# Altium schematic sheet machtangap.SchDoc
size A4; SheetNumber: 1; SheetTotal: 1; SPICEModelCacheJOKNZZKW: <root> / <DocumentId>JOKNZZKW</DocumentId> / <CacheFrame Number="0"> / <Model Name="diode" Kind="MDL"> / <Text>*Default Diode / *Diode Pinout: A,K / .MODEL DIODE D()</Text> / </Model> / <Model Name="nmos" Kind="MDL"> / <Text>*Default N-Channel MOSFET / *Pinout: D,G,S / .MODEL NMOS NMOS()</Text> / </Model> / <Model Name="2n3906" Kind="MDL"> / <Text>*2N3906 / *Si 310mW  40V 200mA 250MHz pkg:TO-92B 1,2,3 / .MODEL 2N3906 PNP(IS=4E-14 BF=400 VAF=50 IKF=0.02 ISE=7E-15 NE=1.16 / + BR=7.5 RC=2.4 CJE=6.3E-12 VJE=0.75 TF=5E-10 CJC=5.8E-12 VJC=0.75 TR=2.3E-8 / + VJS=0.75 XTB=1.5 KF=6E-16 )</Text> / </Model> / </CacheFrame> / </root>
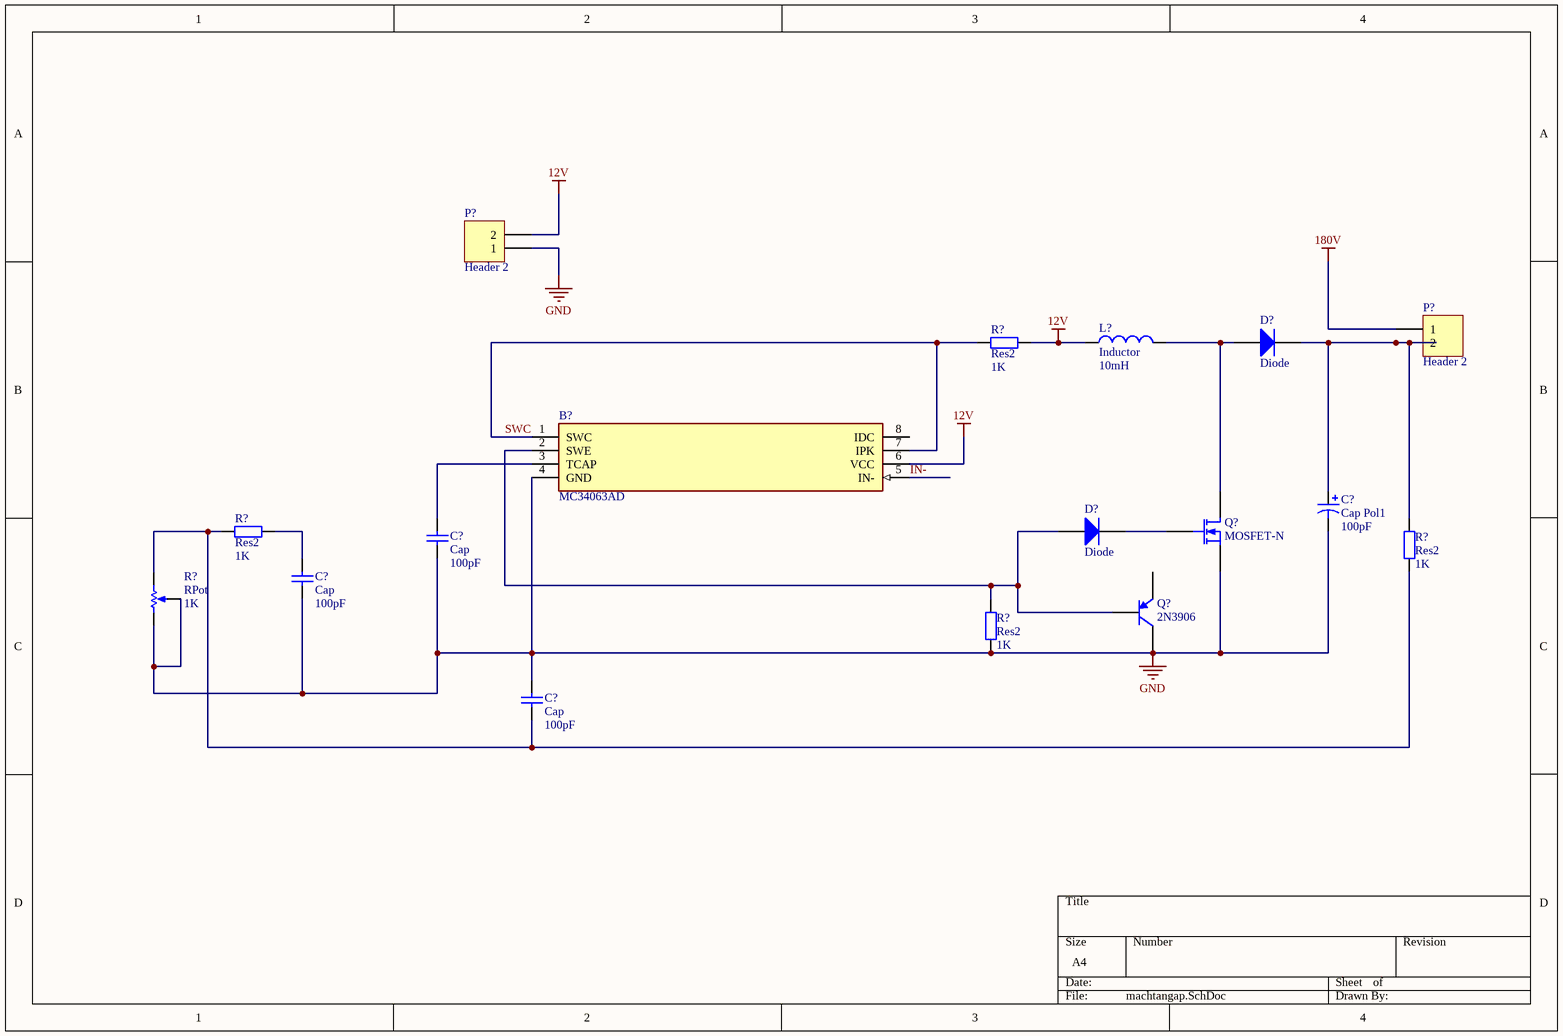
[diagram p0: machtangap.SchDoc]

## Parts
(Parts that share a designator on the sheet are numbered #1, #2 ... from top to bottom, then left to right.)
B?  MC34063AD  [SOIC127P600X175-8N]
C?#1  Cap Pol1  value 100pF  [RB7.6-15]
C?#2  Cap  value 100pF  [RAD-0.3]
C?#3  Cap  value 100pF  [RAD-0.3]
C?#4  Cap  value 100pF  [RAD-0.3]
D?#1  Diode  [SMC]
D?#2  Diode  [SMC]
L?  Inductor  value 10mH  [0402-A]
P?#1  Header 2  [HDR1X2]
P?#2  Header 2  [HDR1X2]
Q?#1  MOSFET-N  [E3]
Q?#2  2N3906  [TO-92A]
R?#1  Res2  value 1K  [AXIAL-0.4]
R?#2  Res2  value 1K  [AXIAL-0.4]
R?#3  Res2  value 1K  [AXIAL-0.4]
R?#4  RPot  value 1K  [VR5]
R?#5  Res2  value 1K  [AXIAL-0.4]

## Nets
12V: B?.6(VCC) L?.1 P?#1.2 R?#1.1
180V: P?#2.1
GND: B?.4(GND) C?#1.2 C?#2.1 C?#3.1 C?#4.2 P?#1.1 Q?#1.3(S) Q?#2.3(C) R?#4.1(TOP) R?#4.3(TAP) R?#5.1
IN-: B?.5(IN-)
SWC: B?.1(SWC) B?.7(IPK) R?#1.2
NetB?_2: B?.2(SWE) D?#2.1(A) Q?#2.2(B) R?#5.2
NetB?_3: B?.3(TCAP) C?#2.2
NetC?#1_1: C?#1.1 D?#1.2(K) P?#2.2 R?#3.2
NetC?#3_2: C?#3.2 R?#2.1
NetC?#4_1: C?#4.1 R?#2.2 R?#3.1 R?#4.2(BOT)
NetD?#1_1: D?#1.1(A) L?.2 Q?#1.1(D)
NetD?#2_2: D?#2.2(K) Q?#1.2(G)

Not connected (* = marked no-connect by the designer): B? 8(IDC); Q?#2 1(E)

## Library data of the parts
B? = MC34063AD: Step up/down converter,MC34063AD 98pcs; Manufacturer_Name: onsemi; Geometry.Height: 1.75mm; Manufacturer_Part_Number: MC34063AD; Mouser Part Number: 512-MC34063AD; Mouser Price/Stock: http://www.mouser.com/Search/ProductDetail.aspx?qs=qJQOsIEC8WHIuBHtgH5ZSQ%3d%3d; Arrow Part Number: MC34063AD; Arrow Price/Stock: https://www.arrow.com/en/products/mc34063ad/on-semiconductor; Datasheet Link: http://www.onsemi.com/pub/Collateral/MC34063A-D.PDF
C?#1 = Cap Pol1: Polarized Capacitor (Radial); Published: 8-Jun-2000; LatestRevisionDate: 17-Jul-2002; LatestRevisionNote: Re-released for DXP Platform.; PackageReference: RB7.6-15; Publisher: Altium Limited; PackageDescription: Polarized Capacitor (Radial); 2 Leads
C?#2-C?#4 = Cap: Capacitor; Published: 8-Jun-2000; LatestRevisionDate: 17-Jul-2002; LatestRevisionNote: Re-released for DXP Platform.; PackageReference: RAD-0.3; Publisher: Altium Limited; PackageDescription: Radial Cap, Thru-Hole; 2 Leads; 0.3 in Pin Spacing
D?#1 D?#2 = Diode: Default Diode; Published: 8-Jun-2000; LatestRevisionDate: 17-Jul-2002; LatestRevisionNote: Re-released for DXP Platform.; PackageVersion: Sep-1996; PackageReference: SMC; Publisher: Altium Limited; PackageDescription: DO-214-AB/SMC; 2 C-Bend Leads; Body 7.9 x 5.9 mm, inc. leads (LxW); Code_JEDEC: DO-214-AB
L? = Inductor: Code_IEC: 1005; Published: 8-Jun-2000; LatestRevisionDate: 29-May-2009; LatestRevisionNote: IPC-7351 Footprint Added.; PackageReference: 0402-A; Publisher: Altium Limited; PackageDescription: Chip Inductor; Code_JEITA: 0402
P?#1 P?#2 = Header 2: Header, 2-Pin; LatestRevisionDate: 17-Jul-2002; LatestRevisionNote: Re-released for DXP Platform.; Publisher: Altium Limited
Q?#1 = MOSFET-N: N-Channel MOSFET; Published: 8-Jun-2000; LatestRevisionDate: 17-Jul-2002; LatestRevisionNote: Re-released for DXP Platform.; PackageVersion: 1995/1996; PackageReference: E3; Publisher: Altium Limited; PackageDescription: TO, Flat Index; 3 In-Line, Axial Leads; Body Dia. 4.6mm; Lead Dia. 0.5 mm (max)
Q?#2 = 2N3906: PNP General Purpose Amplifier; Published: 8-Jun-2000; LatestRevisionDate: 15-Jan-2003; LatestRevisionNote: PCB Footprint 'BCY-W3/D4.7' replaced; DatasheetVersion: 1997; PackageVersion: Sep-1998; PackageReference: TO-92A; Publisher: Altium Limited; PackageDescription: TO, Flat Index; 3 In-Line, Axial Leads; Body Dia. 4.5mm; Leads 0.51 x 0.48 mm (max); ComponentLink1Description: Manufacturer Link; ComponentLink1URL: http://www.fairchildsemi.com/; ComponentLink2Description: Datasheet; ComponentLink2URL: http://www.fairchildsemi.com/ds/2N%2F2N3906.pdf
R?#1-R?#3 R?#5 = Res2: Resistor; Published: 8-Jun-2000; LatestRevisionDate: 17-Jul-2002; LatestRevisionNote: Re-released for DXP Platform.; PackageReference: AXIAL-0.4; Publisher: Altium Limited; PackageDescription: Axial Device, Thru-Hole; 2 Leads; 0.4 in Pin Spacing
R?#4 = RPot: Potentiometer; Sim Note: Enter the Resistance value and the set point into parameter fields.; Set Position: 0.5; Published: 8-Jun-2000; LatestRevisionDate: 17-Jul-2002; LatestRevisionNote: Re-released for DXP Platform.; PackageReference: VR5; Publisher: Altium Limited; PackageDescription: Variable Resistor, Thru-Hole; 3 Leads